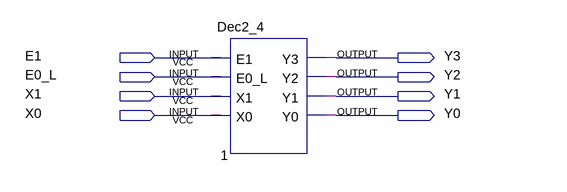
[diagram p0: schematic sheet]
// Quartus schematic DecDemo.bdf as structural Verilog: 1 symbols, 8 pins
module DecDemo (
  input  E1,
  input  E0_L,
  input  X1,
  input  X0,
  output Y3,
  output Y2,
  output Y1,
  output Y0
);

  Dec2_4 u_1 (.E1(E1), .E0_L(E0_L), .X1(X1), .X0(X0), .Y3(Y3), .Y2(Y2), .Y1(Y1), .Y0(Y0));
endmodule
